# EasyEDA Pro project Solkatstice_v1.0_2025-04-18.epro, board Solkatstice
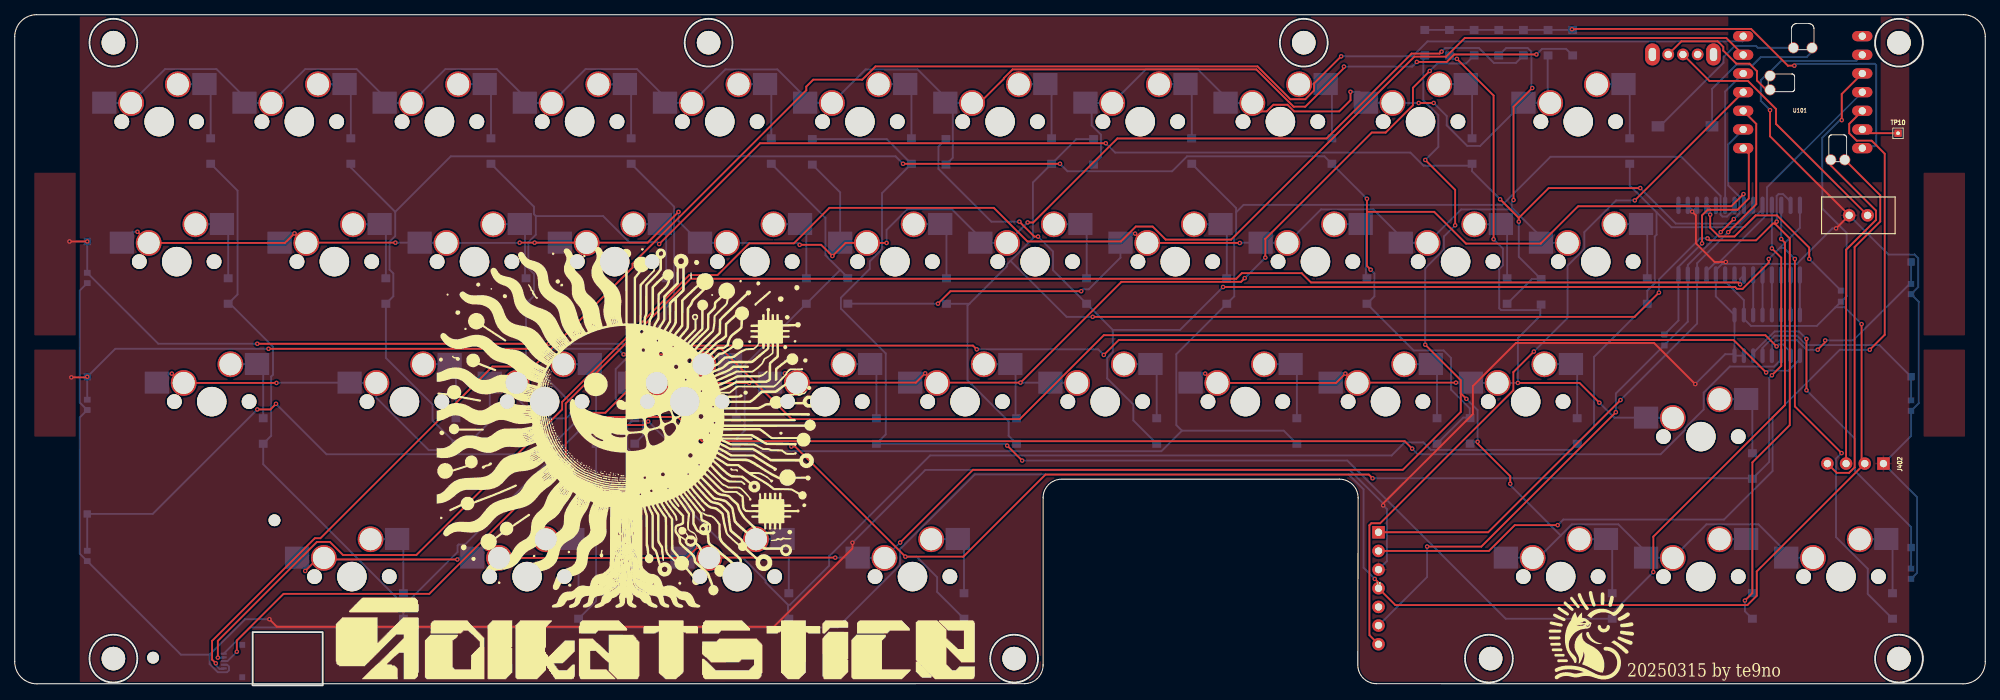
[diagram p1: board, top side]
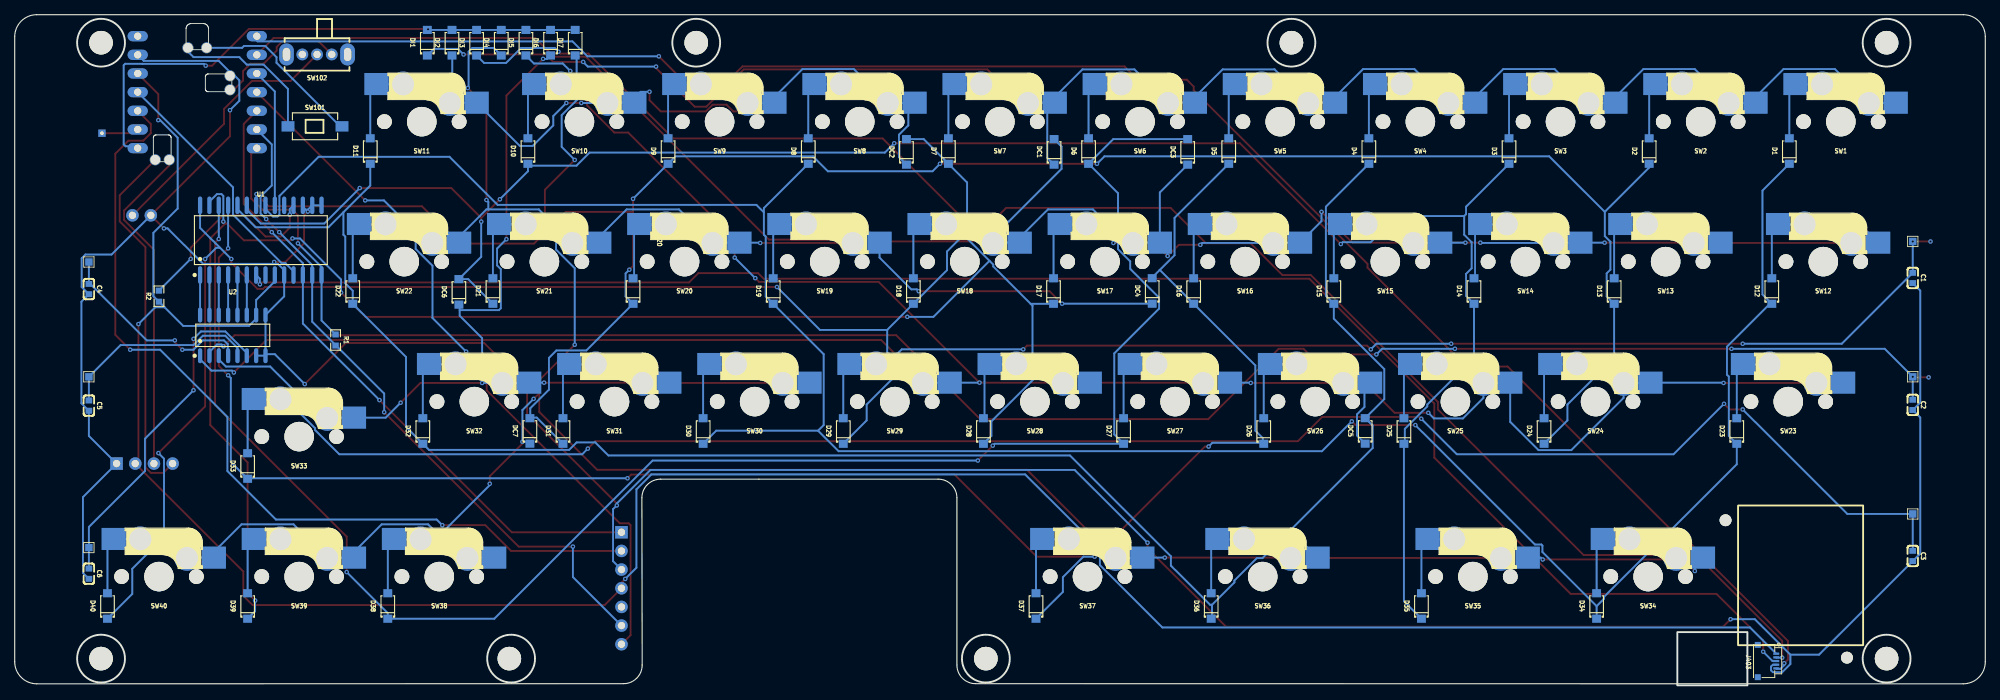
[diagram p2: board, bottom side, seen from below]

Outline 267.84 x 91.26 mm; copper layers: Top Layer, Bottom Layer. Coordinates in mm from the lower left corner of the outline.
Outline path: circle c13.41,87.45 r3.25 ; circle c13.41,3.63 r3.25 ; rectangle 32.33,7.24 41.86,0 ; circle c94.31,87.45 r3.25 ; circle c135.84,3.63 r3.25 ; circle c175.21,87.45 r3.25 ; circle c200.37,3.63 r3.25 ; circle c256.11,87.45 r3.25 ; circle c256.11,3.63 r3.25 ; 0,88.26 arc(0.88,90.38) 3,91.26 264.84,91.26 arc(266.96,90.38) 267.84,88.26 267.84,3.2 arc(266.96,1.08) 264.84,0.2 185.1,0.22 arc(183.3,0.97) 182.56,2.76 182.6,25.51 arc(181.85,27.31) 180.06,28.05 166.7,28.05 142.32,28.05 arc(140.52,27.31) 139.78,25.51 139.78,2.76 arc(139.04,0.97) 137.24,0.22 3,0.2 arc(0.88,1.08) 0,3.2 0,88.26
Stack: Top Layer 0.035mm / Dielectric1 1.51mm FR4 er 4.5 / Bottom Layer 0.035mm

## Design rules (mm)
spacing safeClearance (default): track to track 0.152, other pairs 0.152 to 0.3
track width trackWidth (default): min 0.127, default 0.254, max 2.54
differential pair differentialPair (default): width min 0.127, default 0.254, max 2.54; gap min 0.152, default 0.152
via viaSize (default): diameter min 0.5, default 0.61, max 10; hole min 0.3, default 0.305, max 6
pour ie1754 uses CopperRegion2
pour ie1755 uses CopperRegion3
pour ie1756 uses CopperRegion5
pour ie1757 uses CopperRegion1
pour ie1758 uses CopperRegion4
pour ie1759 uses CopperRegion

## Placement (name value [footprint] x y rotation side)
BT1  Battery_Cell  [kbd_Parts:Battery_2pin]  250.59 63.96 180 top
C1  4.7n  [C0603]  9.86 55.44 270 bottom
C2  20pF  [C0603]  9.86 38.16 270 bottom
C3  20pF  [C0603]  9.86 17.6 270 bottom
C4  20pF  [C0603]  257.76 53.93 270 bottom
C5  20pF  [C0603]  257.76 38.06 270 bottom
C6  20pF  [C0603]  257.76 15.19 270 bottom
D1  D  [SOD-123_L2.7-W1.6-LS3.8-RD]  26.63 72.71 90 bottom
D2  D  [SOD-123_L2.7-W1.6-LS3.8-RD]  45.68 72.71 90 bottom
D3  D  [SOD-123_L2.7-W1.6-LS3.8-RD]  64.73 72.71 90 bottom
D4  D  [SOD-123_L2.7-W1.6-LS3.8-RD]  83.78 72.71 90 bottom
D5  D  [SOD-123_L2.7-W1.6-LS3.8-RD]  102.83 72.71 90 bottom
D6  D  [SOD-123_L2.7-W1.6-LS3.8-RD]  121.88 72.71 90 bottom
D7  D  [SOD-123_L2.7-W1.6-LS3.8-RD]  140.93 72.71 90 bottom
D8  D  [SOD-123_L2.7-W1.6-LS3.8-RD]  159.98 72.71 90 bottom
D9  D  [SOD-123_L2.7-W1.6-LS3.8-RD]  179.03 72.71 90 bottom
D10  D  [SOD-123_L2.7-W1.6-LS3.8-RD]  198.08 72.71 90 bottom
D11  D  [SOD-123_L2.7-W1.6-LS3.8-RD]  219.52 72.71 90 bottom
D12  D  [SOD-123_L2.7-W1.6-LS3.8-RD]  29.02 53.66 90 bottom
D13  D  [SOD-123_L2.7-W1.6-LS3.8-RD]  50.45 53.66 90 bottom
D14  D  [SOD-123_L2.7-W1.6-LS3.8-RD]  69.5 53.66 90 bottom
D15  D  [SOD-123_L2.7-W1.6-LS3.8-RD]  88.55 53.66 90 bottom
D16  D  [SOD-123_L2.7-W1.6-LS3.8-RD]  107.6 53.66 90 bottom
D17  D  [SOD-123_L2.7-W1.6-LS3.8-RD]  126.65 53.66 90 bottom
D18  D  [SOD-123_L2.7-W1.6-LS3.8-RD]  145.7 53.66 90 bottom
D19  D  [SOD-123_L2.7-W1.6-LS3.8-RD]  164.75 53.66 90 bottom
D20  D  [SOD-123_L2.7-W1.6-LS3.8-RD]  183.8 53.66 90 bottom
D21  D  [SOD-123_L2.7-W1.6-LS3.8-RD]  202.85 53.66 90 bottom
D22  D  [SOD-123_L2.7-W1.6-LS3.8-RD]  221.9 53.66 90 bottom
D23  D  [SOD-123_L2.7-W1.6-LS3.8-RD]  33.78 34.61 90 bottom
D24  D  [SOD-123_L2.7-W1.6-LS3.8-RD]  59.97 34.61 90 bottom
D25  D  [SOD-123_L2.7-W1.6-LS3.8-RD]  79.02 34.61 90 bottom
D26  D  [SOD-123_L2.7-W1.6-LS3.8-RD]  98.07 34.61 90 bottom
D27  D  [SOD-123_L2.7-W1.6-LS3.8-RD]  117.12 34.61 90 bottom
D28  D  [SOD-123_L2.7-W1.6-LS3.8-RD]  136.17 34.61 90 bottom
D29  D  [SOD-123_L2.7-W1.6-LS3.8-RD]  155.22 34.61 90 bottom
D30  D  [SOD-123_L2.7-W1.6-LS3.8-RD]  174.27 34.61 90 bottom
D31  D  [SOD-123_L2.7-W1.6-LS3.8-RD]  193.32 34.61 90 bottom
D32  D  [SOD-123_L2.7-W1.6-LS3.8-RD]  212.37 34.61 90 bottom
D33  D  [SOD-123_L2.7-W1.6-LS3.8-RD]  236.18 29.85 90 bottom
D34  D  [SOD-123_L2.7-W1.6-LS3.8-RD]  52.83 10.8 90 bottom
D35  D  [SOD-123_L2.7-W1.6-LS3.8-RD]  76.64 10.8 90 bottom
D36  D  [SOD-123_L2.7-W1.6-LS3.8-RD]  105.22 10.8 90 bottom
D37  D  [SOD-123_L2.7-W1.6-LS3.8-RD]  129.03 10.8 90 bottom
D38  D  [SOD-123_L2.7-W1.6-LS3.8-RD]  217.13 10.8 90 bottom
D39  D  [SOD-123_L2.7-W1.6-LS3.8-RD]  236.18 10.8 90 bottom
D40  D  [SOD-123_L2.7-W1.6-LS3.8-RD]  255.23 10.8 90 bottom
DC1  D  [SOD-123_L2.7-W1.6-LS3.8-RD]  126.57 72.59 90 bottom
DC2  D  [SOD-123_L2.7-W1.6-LS3.8-RD]  146.64 72.59 90 bottom
DC3  D  [SOD-123_L2.7-W1.6-LS3.8-RD]  108.41 72.59 90 bottom
DC4  D  [SOD-123_L2.7-W1.6-LS3.8-RD]  113.24 53.67 90 bottom
DC5  D  [SOD-123_L2.7-W1.6-LS3.8-RD]  84.28 34.62 90 bottom
DC6  D  [SOD-123_L2.7-W1.6-LS3.8-RD]  207.47 53.54 90 bottom
DC7  D  [SOD-123_L2.7-W1.6-LS3.8-RD]  197.82 34.62 90 bottom
DI1  D  [SOD-123_L2.7-W1.6-LS3.8-RD]  211.76 87.45 90 bottom
DI2  D  [SOD-123_L2.7-W1.6-LS3.8-RD]  208.41 87.45 90 bottom
DI3  D  [SOD-123_L2.7-W1.6-LS3.8-RD]  205.06 87.45 90 bottom
DI4  D  [SOD-123_L2.7-W1.6-LS3.8-RD]  201.71 87.45 90 bottom
DI5  D  [SOD-123_L2.7-W1.6-LS3.8-RD]  198.36 87.45 90 bottom
DI6  D  [SOD-123_L2.7-W1.6-LS3.8-RD]  195.01 87.45 90 bottom
DI7  D  [SOD-123_L2.7-W1.6-LS3.8-RD]  191.66 87.45 90 bottom
J1  ~  [roBa:pmw3610_connector]  185.37 13.21 0 top
J402  Conn_01x08  [display:OLED-128x32]  244.2 28.58 90 top
J403  Conn_01x08  [CONN-SMD_5P-P0.50_AFH34-S05FIA-1H]  29.67 3.3 270 bottom
R1  10K  [R0603]  224.23 46.99 270 bottom
R2  10K  [R0603]  248.23 52.96 90 bottom
REF**  -  [MountingHole:MountingHole_3.2mm_M3]  13.41 3.63 0 top
REF**#2  -  [MountingHole:MountingHole_3.2mm_M3]  256.11 87.45 0 top
REF**#3  -  [MountingHole:MountingHole_3.2mm_M3]  256.11 3.63 0 top
REF**#4  -  [MountingHole:MountingHole_3.2mm_M3]  94.31 87.45 0 top
REF**#5  -  [MountingHole:MountingHole_3.2mm_M3]  135.84 3.63 0 top
REF**#6  -  [MountingHole:MountingHole_3.2mm_M3]  200.61 3.63 0 top
REF**#7  -  [MountingHole:MountingHole_3.2mm_M3]  13.41 87.45 0 top
REF**#8  -  [MountingHole:MountingHole_3.2mm_M3]  175.21 87.45 0 top
SW1  SW_PUSH  [kbd_SW:CherryMX_Hotswap_1u]  19.63 76.71 180 bottom
SW2  SW_PUSH  [kbd_SW:CherryMX_Hotswap_1u]  38.68 76.71 180 bottom
SW3  SW_PUSH  [kbd_SW:CherryMX_Hotswap_1u]  57.73 76.71 180 bottom
SW4  SW_PUSH  [kbd_SW:CherryMX_Hotswap_1u]  76.78 76.71 180 bottom
SW5  SW_PUSH  [kbd_SW:CherryMX_Hotswap_1u]  95.83 76.71 180 bottom
SW6  SW_PUSH  [kbd_SW:CherryMX_Hotswap_1u]  114.88 76.71 180 bottom
SW7  SW_PUSH  [kbd_SW:CherryMX_Hotswap_1u]  133.93 76.71 180 bottom
SW8  SW_PUSH  [kbd_SW:CherryMX_Hotswap_1u]  152.98 76.71 180 bottom
SW9  SW_PUSH  [kbd_SW:CherryMX_Hotswap_1u]  172.03 76.71 180 bottom
SW10  SW_PUSH  [kbd_SW:CherryMX_Hotswap_1u]  191.08 76.71 180 bottom
SW11  SW_PUSH  [kbd_SW:CherryMX_Hotswap_1u]  212.52 76.71 180 bottom
SW12  SW_PUSH  [kbd_SW:CherryMX_Hotswap_1u]  22.02 57.66 180 bottom
SW13  SW_PUSH  [kbd_SW:CherryMX_Hotswap_1u]  43.45 57.66 180 bottom
SW14  SW_PUSH  [kbd_SW:CherryMX_Hotswap_1u]  62.5 57.66 180 bottom
SW15  SW_PUSH  [kbd_SW:CherryMX_Hotswap_1u]  81.55 57.66 180 bottom
SW16  SW_PUSH  [kbd_SW:CherryMX_Hotswap_1u]  100.6 57.66 180 bottom
SW17  SW_PUSH  [kbd_SW:CherryMX_Hotswap_1u]  119.65 57.66 180 bottom
SW18  SW_PUSH  [kbd_SW:CherryMX_Hotswap_1u]  138.7 57.66 180 bottom
SW19  SW_PUSH  [kbd_SW:CherryMX_Hotswap_1u]  157.75 57.66 180 bottom
SW20  SW_PUSH  [kbd_SW:CherryMX_Hotswap_1u]  176.8 57.66 180 bottom
SW21  SW_PUSH  [kbd_SW:CherryMX_Hotswap_1u]  195.85 57.66 180 bottom
SW22  SW_PUSH  [kbd_SW:CherryMX_Hotswap_1u]  214.9 57.66 180 bottom
SW23  SW_PUSH  [kbd_SW:CherryMX_Hotswap_1u]  26.78 38.61 180 bottom
SW24  SW_PUSH  [kbd_SW:CherryMX_Hotswap_1u]  52.97 38.61 180 bottom
SW25  SW_PUSH  [kbd_SW:CherryMX_Hotswap_1u]  72.02 38.61 180 bottom
SW26  SW_PUSH  [kbd_SW:CherryMX_Hotswap_1u]  91.07 38.61 180 bottom
SW27  SW_PUSH  [kbd_SW:CherryMX_Hotswap_1u]  110.12 38.61 180 bottom
SW28  SW_PUSH  [kbd_SW:CherryMX_Hotswap_1u]  129.17 38.61 180 bottom
SW29  SW_PUSH  [kbd_SW:CherryMX_Hotswap_1u]  148.22 38.61 180 bottom
SW30  SW_PUSH  [kbd_SW:CherryMX_Hotswap_1u]  167.27 38.61 180 bottom
SW31  SW_PUSH  [kbd_SW:CherryMX_Hotswap_1u]  186.32 38.61 180 bottom
SW32  SW_PUSH  [kbd_SW:CherryMX_Hotswap_1u]  205.37 38.61 180 bottom
SW33  SW_PUSH  [kbd_SW:CherryMX_Hotswap_1u]  229.18 33.85 180 bottom
SW34  SW_PUSH  [kbd_SW:CherryMX_Hotswap_1u]  45.83 14.8 180 bottom
SW35  SW_PUSH  [kbd_SW:CherryMX_Hotswap_1u]  69.64 14.8 180 bottom
SW36  SW_PUSH  [kbd_SW:CherryMX_Hotswap_1u]  98.22 14.8 180 bottom
SW37  SW_PUSH  [kbd_SW:CherryMX_Hotswap_1u]  122.03 14.8 180 bottom
SW38  SW_PUSH  [kbd_SW:CherryMX_Hotswap_1u]  210.13 14.8 180 bottom
SW39  SW_PUSH  [kbd_SW:CherryMX_Hotswap_1u]  229.18 14.8 180 bottom
SW40  SW_PUSH  [kbd_SW:CherryMX_Hotswap_1u]  248.23 14.8 180 bottom
SW101  TSB008A2530A  [SW-SMD_L6.0-W3.5-LS8.0]  227.03 76.07 0 bottom
SW102  SK12D07VG5  [SW-TH_SK12D07VG5]  226.75 85.85 0 bottom
TP1  TestPoint  [TestPoint:TestPoint_Pad_1.0x1.0mm]  9.86 60.4 180 bottom
TP2  TestPoint  [TestPoint:TestPoint_Pad_1.0x1.0mm]  9.86 41.99 180 bottom
TP3  TestPoint  [TestPoint:TestPoint_Pad_1.0x1.0mm]  9.86 23.32 180 bottom
TP4  TestPoint  [TestPoint:TestPoint_Pad_1.0x1.0mm]  257.76 57.61 180 bottom
TP5  TestPoint  [TestPoint:TestPoint_Pad_1.0x1.0mm]  257.76 41.99 180 bottom
TP6  TestPoint  [TestPoint:TestPoint_Pad_1.0x1.0mm]  257.76 18.75 0 bottom
TP10  TestPoint  [TestPoint:TestPoint_THTPad_1.0x1.0mm_Drill0.5mm]  255.98 75.13 0 top
U1  xiao-ble  [SOIC-28_L17.9-W7.5-P1.27-LS10.3-BL]  234.39 60.58 180 bottom
U2  BS816A-1  [NSOP-16_L9.9-W3.9-P1.27-LS6.0-BL]  238.2 47.62 180 bottom
U101  xiao-ble  [mcu:xiao-ble-tht]  243.03 80.72 0 top
U102  -  [Joystick]  33.6 5.46 180 top

## Footprints (pads in the part's own frame, mm; a bottom-side part is the same pattern mirrored in y, then rotated)
C0603
  rect 0.8x0.9 smd: 1(-0.7,0) 2(0.7,0)
CONN-SMD_5P-P0.50_AFH34-S05FIA-1H
  rect 0.3x0.8 smd: 1(-1,1.254) 2(-0.5,1.256) 3(0,1.256) 4(0.5,1.256) 5(1,1.256)
  rect 0.8x0.8 smd: 6(2.2,-1.256) 7(-2.2,-1.256)
display:OLED-128x32
  round 1.7 hole 1: 1(1.6,-2.18) 2(1.6,-4.72) 3(1.6,-7.26)
  rect 1.7x1.7 hole 1: 4(1.6,-9.8)
Joystick
  round 1.6 hole 1.6: 1(-1.7,-17) 1(14.8,1.7)
kbd_Parts:Battery_2pin
  round 1.7 hole 1: 1(-1.25,0) 2(1.25,0)
kbd_SW:CherryMX_Hotswap_1u
  round 2 hole 2: (-5.08,0) (5.08,0)
  round 4 hole 4: (0,0)
  round 3.5 hole 3: 1(3.81,2.54) 2(-2.54,5.08)
  rect 3.3x3 smd: 1(7.45,2.58) 2(-6.15,5.12)
mcu:xiao-ble-tht
  oval 2.75x1.4 hole 1: 1(-8.095,7.62) 2(-8.095,5.08) 3(-8.095,2.54) 4(-8.095,0) 5(-8.095,-2.54) 6(-8.095,-5.08) 7(-8.095,-7.62) 8(8.095,-7.62) 9(8.095,-5.08) 10(8.095,-2.54) 11(8.095,0) 12(8.095,2.54) 13(8.095,5.08) 14(8.095,7.62)
  round 1.5 hole 1.3: 17(-1.271,6.031) 18(1.269,6.031) 19(-4.446,0.316) 20(-4.446,2.221) 21(3.809,-9.209) 22(5.714,-9.209)
MountingHole:MountingHole_3.2mm_M3
  round 3.2 hole 3.2: (0,0)
NSOP-16_L9.9-W3.9-P1.27-LS6.0-BL
  oval 0.574x2.038 smd: 1(-4.445,-2.769) 2(-3.175,-2.769) 3(-1.905,-2.769) 4(-0.635,-2.769) 5(0.635,-2.769) 6(1.905,-2.769) 7(3.175,-2.769) 8(4.445,-2.769) 9(4.445,2.769) 10(3.175,2.769) 11(1.905,2.769) 12(0.635,2.769) 13(-0.635,2.769) 14(-1.905,2.769) 15(-3.175,2.769) 16(-4.445,2.769)
R0603
  rect 0.806x0.864 smd: 1(-0.753,0) 2(0.753,0)
roBa:pmw3610_connector
  rect 1.7x1.7 hole 1: 1(0,7.62)
  round 1.7 hole 1: 2(0,5.08) 3(0,2.54) 4(0,0) 5(0,-2.54) 6(0,-5.08) 7(0,-7.62)
SOD-123_L2.7-W1.6-LS3.8-RD
  rect 1.1x1.2 smd: 1(-1.735,0) 2(1.735,0)
SOIC-28_L17.9-W7.5-P1.27-LS10.3-BL
  oval 0.574x2.388 smd: 1(-8.255,-4.744) 2(-6.985,-4.744) 3(-5.715,-4.744) 4(-4.445,-4.744) 5(-3.175,-4.744) 6(-1.905,-4.744) 7(-0.635,-4.744) 8(0.635,-4.744) 9(1.905,-4.744) 10(3.175,-4.744) 11(4.445,-4.744) 12(5.715,-4.744) 13(6.985,-4.744) 14(8.255,-4.744) 15(8.255,4.744) 16(6.985,4.744) 17(5.715,4.744) 18(4.445,4.744) 19(3.175,4.744) 20(1.905,4.744) 21(0.635,4.744) 22(-0.635,4.744) 23(-1.905,4.744) 24(-3.175,4.744) 25(-4.445,4.744) 26(-5.715,4.744) 27(-6.985,4.744) 28(-8.255,4.744)
SW-SMD_L6.0-W3.5-LS8.0
  rect 1.74x1.4 smd: 1(-3.67,0) 2(3.67,0)
SW-TH_SK12D07VG5
  oval 1.6x1.6 hole 1: 1(-2,0) 2(0,0) 3(2,0)
  oval 2x3 hole 1x1.8: 4(4.15,0) 5(-4.15,0)
TestPoint:TestPoint_Pad_1.0x1.0mm
  rect 1x1 smd: 1(0,0)
TestPoint:TestPoint_THTPad_1.0x1.0mm_Drill0.5mm
  rect 1x1 hole 0.5: 1(0,0)

## Nets
3.3V: J1.4 J402.3 J403.1 R2.1 U1.9 U2.10 U101.12
GND: BT1.2 C1.2 C2.2 C3.2 C4.2 C5.2 C6.2 J1.3 J402.4 J403.4 U1.10 U1.15 U1.16 U1.17 U2.7 U2.8 U2.9 U101.13 U101.20
BAT+: SW102.1 U101.19
CS1: U1.11 U101.11
CS2: J1.2 U101.10
INT: DI1.2 DI2.2 DI3.2 DI4.2 DI5.2 DI6.2 DI7.2 U101.8
INTA: U1.20 U101.3
MISO: R1.1 U1.14 U101.7
MOSI: J1.6 R1.2 U1.13 U101.6
MOT: J1.7 U101.4
NET-(BT1-+): BT1.1 SW102.2
NET-(D1-A): D1.2 SW1.2
NET-(D2-A): D2.2 SW2.2
NET-(D3-A): D3.2 SW3.2
NET-(D4-A): D4.2 SW4.2
NET-(D5-A): D5.2 SW5.2
NET-(D6-A): D6.2 SW6.2
NET-(D7-A): D7.2 SW7.2
NET-(D8-A): D8.2 SW8.2
NET-(D9-A): D9.2 SW9.2
NET-(D10-A): D10.2 SW10.2
NET-(D11-A): D11.2 SW11.2
NET-(D12-A): D12.2 SW12.2
NET-(D13-A): D13.2 SW13.2
NET-(D14-A): D14.2 SW14.2
NET-(D15-A): D15.2 SW15.2
NET-(D16-A): D16.2 SW16.2
NET-(D17-A): D17.2 SW17.2
NET-(D18-A): D18.2 SW18.2
NET-(D19-A): D19.2 SW19.2
NET-(D20-A): D20.2 SW20.2
NET-(D21-A): D21.2 SW21.2
NET-(D22-A): D22.2 SW22.2
NET-(D23-A): D23.2 SW23.2
NET-(D24-A): D24.2 SW24.2
NET-(D25-A): D25.2 SW25.2
NET-(D26-A): D26.2 SW26.2
NET-(D27-A): D27.2 SW27.2
NET-(D28-A): D28.2 SW28.2
NET-(D29-A): D29.2 SW29.2
NET-(D30-A): D30.2 SW30.2
NET-(D31-A): D31.2 SW31.2
NET-(D32-A): D32.2 SW32.2
NET-(D33-A): D33.2 SW33.2
NET-(D34-A): D34.2 SW34.2
NET-(D35-A): D35.2 SW35.2
NET-(D36-A): D36.2 SW36.2
NET-(D37-A): D37.2 SW37.2
NET-(D38-A): D38.2 SW38.2
NET-(D39-A): D39.2 SW39.2
NET-(D40-A): D40.2 SW40.2
NET-(DC1-K): DC1.1 DI1.1 SW1.1 SW2.1 SW3.1 SW4.1 SW5.1 SW6.1 SW7.1
NET-(DC2-K): DC2.1 DI2.1 SW8.1 SW9.1 SW10.1 SW11.1
NET-(DC3-K): DC3.1 DI3.1 SW12.1 SW13.1 SW14.1 SW15.1 SW16.1 SW17.1 SW18.1
NET-(DC4-K): DC4.1 DI4.1 SW19.1 SW20.1 SW21.1 SW22.1
NET-(DC5-K): DC5.1 DI5.1 SW23.1 SW24.1 SW25.1 SW26.1 SW27.1 SW28.1 SW29.1
NET-(DC6-K): DC6.1 DI6.1 SW30.1 SW31.1 SW32.1 SW33.1
NET-(DC7-K): DC7.1 DI7.1 SW34.1 SW35.1 SW36.1 SW37.1 SW38.1 SW39.1 SW40.1
NET-(SW101-PAD2): SW101.2 U101.18
NET-(U1-~{RESET}): R2.2 U1.18
NET-(U2-KEY1): C1.1 TP1.1 U2.1
NET-(U2-KEY2): C2.1 TP2.1 U2.2
NET-(U2-KEY3): C3.1 TP3.1 U2.3
NET-(U2-KEY4): C4.1 TP4.1 U2.4
NET-(U2-KEY5): C5.1 TP5.1 U2.5
NET-(U2-KEY6): C6.1 TP6.1 U2.6
NET-(U101-A7_SCK{SLASH}1.13): TP10.1 U101.9
NET-(U101-RESET): SW101.1 U101.17
S0: D1.1 D8.1 D12.1 D19.1 D23.1 D30.1 D34.1 U1.21
S1: D2.1 D9.1 D13.1 D20.1 D24.1 D31.1 DC7.2 U1.22
S2: D3.1 D10.1 D14.1 D21.1 D25.1 D35.1 DC6.2 U1.23
S3: D4.1 D11.1 D15.1 D22.1 D32.1 D36.1 DC5.2 U1.24
S4: D5.1 D16.1 D26.1 D33.1 D37.1 DC4.2 U1.25
S5: D6.1 D27.1 D38.1 DC3.2 U1.26
S6: D7.1 D17.1 D28.1 D39.1 DC2.2 U1.27
S7: D18.1 D29.1 D40.1 DC1.2 U1.28
S8: U1.1 U2.16
S9: U1.2 U2.15
S10: U1.3 U2.14
S11: U1.4 U2.13
S12: U1.5 U2.12
S13: U1.6 U2.11
S14: J403.3 U1.7
SCK: J1.1 U1.12 U101.5
SCL: J402.2 U101.21
SDA: J402.1 U101.22
UNCONNECTED-(J1-NC-PAD5): J1.5
UNCONNECTED-(SW102-C-PAD3): SW102.3
UNCONNECTED-(U1-GPB7-PAD8): U1.8
UNCONNECTED-(U1-INTB-PAD19): U1.19
UNCONNECTED-(U101-5V-PAD14): U101.14
X: J403.2 U101.2
Y: J403.5 U101.1

Pads without a net: J403 6 7; SW102 4 5; U102 1

## Via types
v1: diameter 0.61, hole 0.305, Top Layer to Bottom Layer, 138 vias

## Routing (per net, layer and track width the routed paths; a pad name or vN(x,y) marks a point on that pad's centre or on a via; arc(x,y) is an arc through that point)
3.3V: length 339.2
  Top Layer w0.254: U101.12 248.33,80.47 v1(248.33,76.91) ; v1(251.03,49.16) 251.03,30.61 J402.3 236.78,15.49 236.78,12.19 235.51,10.92 187.66,10.92 J1.4 185.37,13.97 v1(184.86,14.48)
  Bottom Layer w0.254: U1.9 232.49,54.97 235.03,52.43 U2.10 235.03,49.89 236.01,48.9 244.93,48.9 247.47,51.44 ; 247.47,51.44 R2.1 249,52.97 249,61.58 245.69,64.88 245.69,74.53 248.08,76.91 v1(248.33,76.91) ; 247.47,51.44 248.74,51.44 v1(251.03,49.16) ; J403.1 31.98,7.87 111.86,7.87 120.35,16.36 120.35,18.54 130.51,28.7 181.31,28.7 183.34,26.67 183.34,16 v1(184.86,14.48)
GND: length 461.3
  Top Layer w0.254: v1(228.42,41) 222.83,46.58 204.04,46.58 198.2,40.74 198.2,36.93 186,24.74 v1(186,24.49) ; v1(232.58,57.61) 231.05,57.61 228.51,60.15 228.51,63.96 v1(228,64.47) ; v1(247.56,62.18) BT1.2 238.58,74.72 v1(238.58,78.27) ; v1(34.62,8.99) 35.64,7.98 103.2,7.98 113.87,18.64 v1(113.87,19.41)
  Bottom Layer w0.254: J1.3 186.51,16.89 186.51,23.98 v1(186,24.49) 186,24.74 181.43,29.31 123.77,29.31 v1(113.87,19.41) ; v1(228,64.47) 228.26,64.72 ; 228.26,64.72 228.68,65.14 U1.17 ; 228.26,64.72 228.01,64.72 U1.16 U1.15 ; v1(228.42,41) 232.49,45.06 233.76,45.06 ; 233.76,45.06 U2.8 U2.7 ; 233.76,45.06 U2.9 231.22,52.93 U1.10 231.31,55.93 231.31,56.59 232.07,57.35 232.58,57.35 ; C1.2 8.84,53.72 8.84,38.48 C2.2 8.84,36.45 8.84,17.92 C3.2 22.6,4.17 26.49,4.17 ; BT1.2 254.67,58.62 258.23,58.62 258.74,58.12 258.74,54.2 C4.2 258.78,52.21 258.78,38.38 C5.2 257.76,33.94 J402.4 258.57,25.6 258.57,15.3 C6.2 ; 232.58,57.35 v1(232.58,57.61) ; 232.58,57.35 242.23,57.35 247.06,62.18 v1(247.56,62.18) ; 26.49,4.17 26.49,2.9 27.6,1.79 28.87,1.79 29.13,2.04 29.13,2.55 28.87,2.8 J403.4 ; 26.49,4.17 31.32,8.99 v1(34.62,8.99) ; U101.13 250.3,84.98 240.11,84.98 238.58,83.45 U101.20 237.92,82.94 237.31,82.34 237.31,79.54 v1(238.58,78.27)
BAT+: length 18.4
  Top Layer w0.254: SW102.1 226.54,87.64 231.47,87.64 232.23,86.88 232.23,86.37 234.01,84.59 235.79,84.59 236.81,83.58 236.81,82.31 238.08,81.04 238.58,81.04
CS1: length 34
  Bottom Layer w0.254: U101.11 238.17,67.77 238.17,64.06 231.57,57.46 231.06,57.46 229.95,56.34 U1.11
CS2: length 119.7
  Top Layer w0.254: U101.10 249.35,76.4 249.35,75.13 250.36,74.12 252.4,74.12 254.17,72.34 254.17,47.7 v1(252.14,45.67) ; J1.2 200.37,18.29 203.88,21.79 v1(209.72,21.79)
  Bottom Layer w0.254: v1(252.14,45.67) 248.08,45.67 238.93,36.53 238.93,29.16 232.33,22.56 210.49,22.56 v1(209.72,21.79)
INT: length 76.8
  Top Layer w0.254: v1(241.88,84.33) 241.01,84.33 236.02,89.32 212.21,89.32 212.17,89.28 v1(211.66,89.28)
  Bottom Layer w0.254: DI1.2 211.75,89.19 ; 211.75,89.19 DI2.2 DI3.2 DI4.2 DI5.2 DI6.2 DI7.2 ; 211.75,89.19 v1(211.66,89.28) ; v1(241.88,84.33) 242.13,84.57 250.47,84.57 250.48,84.58 252.84,84.58 253.03,84.39 253.03,73.61 252.78,73.36 251.38,73.36 U101.8
INTA: length 19
  Bottom Layer w0.254: U101.3 232.49,80.81 U1.20
MISO: length 32.8
  Top Layer w0.254: v1(229.35,60.15) 229.35,63.96 230.11,64.72 234.17,64.72 235.7,66.24 235.7,72.34 U101.7
  Bottom Layer w0.254: R1.1 226.14,49.65 U1.14 226.14,56.94 v1(229.35,60.15)
MOSI: length 93.7
  Top Layer w0.254: v1(233.67,63.45) v1(231.89,61.67) ; v1(217.63,37.17) 199.34,18.88 v1(191.97,18.88)
  Bottom Layer w0.254: v1(231.89,61.67) 227.41,57.19 U1.13 227.41,49.48 224.23,46.31 ; 224.23,46.31 R1.2 ; 224.23,46.31 217.63,39.71 v1(217.63,37.17) ; v1(191.97,18.88) 191.97,14.73 J1.6 ; v1(233.67,63.45) 234.43,64.21 234.43,66.5 232.9,68.02 232.9,73.61 U101.6
MOT: length 98.9
  Top Layer w0.254: J1.7 184.14,6.82 184.14,21.79 184.39,22.05 185.59,22.05 203.69,40.15 203.69,42.62 v1(206.49,45.42) ; U101.4 v1(220.2,65.99)
  Bottom Layer w0.254: v1(206.49,45.42) 211.06,49.99 211.06,57.1 213.34,59.39 213.34,61.67 217.66,65.99 v1(220.2,65.99)
NET-(BT1-+): length 35.4
  Top Layer w0.254: BT1.1 239.4,76.4 239.4,78.44 235.59,82.25 230.36,82.25 SW102.2
NET-(D1-A): length 11.3
  Bottom Layer w0.254: SW1.2 25.73,81.79 ; 25.73,81.79 26.63,80.88 D1.2 ; 25.73,81.79 SW1.2
NET-(D2-A): length 11.3
  Bottom Layer w0.254: 44.78,81.79 45.68,80.88 D2.2 ; 44.78,81.79 SW2.2 ; 44.78,81.79 SW2.2
NET-(D3-A): length 11.3
  Bottom Layer w0.254: SW3.2 63.83,81.79 ; 63.83,81.79 64.73,80.88 D3.2 ; 63.83,81.79 SW3.2
NET-(D4-A): length 11.4
  Bottom Layer w0.254: SW4.2 82.89,81.79 SW4.2 83.78,80.98 D4.2
NET-(D5-A): length 11.4
  Bottom Layer w0.254: D5.2 102.83,80.98 SW5.2 101.94,81.79 SW5.2
NET-(D6-A): length 11.4
  Bottom Layer w0.254: SW6.2 120.99,81.79 SW6.2 121.88,80.98 D6.2
NET-(D7-A): length 11.4
  Bottom Layer w0.254: D7.2 140.93,80.98 SW7.2 140.04,81.79 SW7.2
NET-(D8-A): length 11.4
  Bottom Layer w0.254: SW8.2 159.09,81.79 SW8.2 159.98,80.98 D8.2
NET-(D9-A): length 11.4
  Bottom Layer w0.254: D9.2 179.03,80.98 SW9.2 178.14,81.79 SW9.2
NET-(D10-A): length 11.4
  Bottom Layer w0.254: SW10.2 197.19,81.79 SW10.2 198.08,80.98 D10.2
NET-(D11-A): length 11.3
  Bottom Layer w0.254: SW11.2 218.61,81.79 ; 218.61,81.79 SW11.2 ; 218.61,81.79 219.52,80.88 219.52,74.44
NET-(D12-A): length 11.3
  Bottom Layer w0.254: 28.11,62.74 SW12.2 ; 28.11,62.74 SW12.2 ; 28.11,62.74 29.02,61.83 29.02,55.39
NET-(D13-A): length 11.3
  Bottom Layer w0.254: 49.54,62.74 50.45,61.83 D13.2 ; 49.54,62.74 SW13.2 ; 49.54,62.74 SW13.2
NET-(D14-A): length 11.3
  Bottom Layer w0.254: 68.59,62.74 69.35,61.98 69.35,55.53 D14.2 ; 68.59,62.74 SW14.2 ; 68.59,62.74 SW14.2
NET-(D15-A): length 11.3
  Bottom Layer w0.254: SW15.2 87.64,62.74 ; 87.64,62.74 88.55,61.83 D15.2 ; 87.64,62.74 SW15.2
NET-(D16-A): length 11.3
  Bottom Layer w0.254: 106.69,62.74 SW16.2 ; 106.69,62.74 SW16.2 ; 106.69,62.74 107.6,61.83 D16.2
NET-(D17-A): length 11.3
  Bottom Layer w0.254: 125.74,62.74 125.76,62.74 SW17.2 ; 125.74,62.74 126.65,61.83 D17.2 ; 125.74,62.74 SW17.2
NET-(D18-A): length 11.3
  Bottom Layer w0.254: SW18.2 144.81,62.74 144.79,62.74 ; SW18.2 144.79,62.74 ; 144.79,62.74 145.7,61.83 D18.2
NET-(D19-A): length 11.3
  Bottom Layer w0.254: SW19.2 163.86,62.74 163.84,62.74 ; D19.2 164.75,61.83 163.84,62.74 ; 163.84,62.74 SW19.2
NET-(D20-A): length 11.3
  Bottom Layer w0.254: SW20.2 182.91,62.74 182.89,62.74 ; SW20.2 182.89,62.74 ; 182.89,62.74 183.66,61.98 183.66,55.53 D20.2
NET-(D21-A): length 11.3
  Bottom Layer w0.254: 201.94,62.74 SW21.2 ; 201.94,62.74 SW21.2 ; 201.94,62.74 202.85,61.83 D21.2
NET-(D22-A): length 11.3
  Bottom Layer w0.254: 220.99,62.74 SW22.2 ; 220.99,62.74 SW22.2 ; 220.99,62.74 221.9,61.83 D22.2
NET-(D23-A): length 11.3
  Bottom Layer w0.254: SW23.2 32.87,43.69 ; 32.87,43.69 SW23.2 ; 32.87,43.69 33.78,42.78 D23.2
NET-(D24-A): length 11.3
  Bottom Layer w0.254: 59.07,43.69 59.97,42.78 D24.2 ; 59.07,43.69 SW24.2 ; 59.07,43.69 SW24.2
NET-(D25-A): length 11.3
  Bottom Layer w0.254: D25.2 79.02,42.78 78.12,43.69 ; 78.12,43.69 SW25.2 ; 78.12,43.69 SW25.2
NET-(D26-A): length 11.3
  Bottom Layer w0.254: 97.17,43.69 98.07,42.78 D26.2 ; 97.17,43.69 SW26.2 ; 97.17,43.69 SW26.2
NET-(D27-A): length 11.3
  Bottom Layer w0.254: 116.22,43.69 117.12,42.78 D27.2 ; 116.22,43.69 116.23,43.69 SW27.2 ; 116.22,43.69 SW27.2
NET-(D28-A): length 11.3
  Bottom Layer w0.254: SW28.2 135.27,43.69 ; 135.27,43.69 135.28,43.69 SW28.2 ; 135.27,43.69 136.03,42.93 136.03,36.48 D28.2
NET-(D29-A): length 11.3
  Bottom Layer w0.254: SW29.2 154.32,43.69 ; 154.32,43.69 154.33,43.69 SW29.2 ; 154.32,43.69 155.22,42.78 D29.2
NET-(D30-A): length 11.3
  Bottom Layer w0.254: D30.2 174.27,42.78 173.37,43.69 ; 173.37,43.69 173.38,43.69 SW30.2 ; 173.37,43.69 SW30.2
NET-(D31-A): length 11.3
  Bottom Layer w0.254: D31.2 193.32,42.78 192.42,43.69 ; SW31.2 192.42,43.69 ; 192.42,43.69 SW31.2
NET-(D32-A): length 11.3
  Bottom Layer w0.254: D32.2 212.37,42.78 211.47,43.69 ; 211.47,43.69 SW32.2 ; 211.47,43.69 SW32.2
NET-(D33-A): length 11.4
  Bottom Layer w0.254: SW33.2 235.29,38.93 SW33.2 236.18,38.12 D33.2
NET-(D34-A): length 11.4
  Bottom Layer w0.254: SW34.2 51.94,19.88 SW34.2 52.83,19.07 D34.2
NET-(D35-A): length 11.3
  Bottom Layer w0.254: D35.2 76.64,18.97 75.74,19.88 ; SW35.2 75.74,19.88 ; 75.74,19.88 SW35.2
NET-(D36-A): length 11.3
  Bottom Layer w0.254: 104.31,19.88 SW36.2 ; 104.31,19.88 105.22,18.97 105.22,12.53 ; 104.31,19.88 SW36.2
NET-(D37-A): length 11.4
  Bottom Layer w0.254: SW37.2 128.14,19.88 SW37.2 129.03,19.07 D37.2
NET-(D38-A): length 11.4
  Bottom Layer w0.254: D38.2 217.13,19.07 SW38.2 216.24,19.88 SW38.2
NET-(D39-A): length 11.4
  Bottom Layer w0.254: D39.2 236.18,19.07 SW39.2 235.29,19.88 SW39.2
NET-(D40-A): length 11.4
  Bottom Layer w0.254: D40.2 255.23,19.07 SW40.2 254.34,19.88 SW40.2
NET-(DC1-K): length 242.2
  Top Layer w0.254: v1(206.83,85.85) 195.66,85.85 194.64,84.84 v1(190.58,84.84) ; v1(180.67,84.2) 180.67,84 175.42,78.74 173.83,78.74 168.76,83.82 135.63,83.82 134.45,82.63 134.45,82.55 131.14,79.25 SW7.1
  Bottom Layer w0.254: SW7.1 130.08,79.29 SW7.1 ; SW7.1 126.48,80.05 122.71,83.82 115.65,83.82 SW6.1 111.03,79.29 SW6.1 107.43,80.05 103.66,83.82 96.6,83.82 SW5.1 91.98,79.29 SW5.1 88.38,80.05 84.57,83.86 77.59,83.86 SW4.1 69.37,79.25 SW4.1 69.33,80.05 65.52,83.86 58.54,83.86 SW3.1 50.32,79.25 SW3.1 50.28,80.05 46.47,83.86 39.49,83.86 SW2.1 31.27,79.25 SW2.1 31.23,80.05 27.42,83.86 20.44,83.86 SW1.1 12.22,79.25 SW1.1 ; SW7.1 127.5,78.27 127.5,71.79 DC1.1 ; v1(206.83,85.85) 207.59,86.61 210.87,86.61 DI1.1 ; v1(190.58,84.84) 189.94,84.2 v1(180.67,84.2)
NET-(DC2-K): length 93.1
  Top Layer w0.254: SW9.1 169.37,78.1 170.18,78.1 171.08,79.01 172.99,79.01 173.89,78.1 180.04,78.1 181.56,79.63 v1(181.56,80.77) ; v1(190.83,79.25) v1(192.86,79.25)
  Bottom Layer w0.254: 146.63,79.25 146.38,78.99 146.38,76.2 147.65,74.93 147.65,71.88 DC2.1 ; 146.63,79.25 145.57,79.25 SW8.1 ; 146.63,79.25 SW8.1 153.79,83.86 160.77,83.86 164.58,80.05 SW9.1 164.62,79.25 SW9.1 ; 208.37,79.29 208.37,85.68 DI2.1 ; 208.37,79.29 SW11.1 ; 208.37,79.29 SW11.1 199.18,73.41 197.43,73.41 194.64,76.2 194.64,77.47 v1(192.86,79.25) ; v1(181.56,80.77) 182.76,80.77 183.81,79.72 183.81,79.47 SW10.1 187.23,79.29 SW10.1 v1(190.83,79.25)
NET-(DC3-K): length 243.8
  Top Layer w0.254: v1(193.94,86.23) 193.68,85.97 189.87,85.97 178.32,74.42 149.87,74.42 138.44,62.99 v1(137.68,62.99) ; v1(51.74,60.24) 39.68,60.24 ; 39.68,60.24 SW13.1 ; 39.68,60.24 39.3,60.24 v1(38.03,61.51) 36.72,60.2 SW12.1 v1(16.68,61.72) ; v1(90.22,64.43) 86.03,60.24 v1(70.66,60.24) v1(68.63,60.24) ; v1(106.69,59.94) 109.62,59.94 v1(111.14,58.42) 112.92,60.2 SW17.1 v1(118.51,60.2)
  Bottom Layer w0.254: SW17.1 112.2,67.07 DC3.1 ; SW17.1 115.8,60.24 SW17.1 ; SW17.1 111.14,59.18 v1(111.14,58.42) ; v1(137.68,62.99) SW18.1 134.85,60.24 SW18.1 131.21,60.28 131.21,60.96 127.4,64.77 121.3,64.77 118.51,61.98 v1(118.51,60.2) ; v1(38.03,61.51) 37.27,61.51 SW13.1 ; v1(106.69,59.94) 106.44,60.2 SW16.1 96.75,60.24 SW16.1 90.22,63.16 v1(90.22,64.43) ; v1(70.66,60.24) SW15.1 77.7,60.24 SW15.1 ; SW12.1 16.05,61.72 v1(16.68,61.72) ; DI3.1 204.05,84.7 201.05,84.7 199.02,86.73 194.44,86.73 v1(193.94,86.23) ; v1(51.74,60.24) SW14.1 58.65,60.24 SW14.1 68.59,60.2 v1(68.63,60.24)
NET-(DC4-K): length 139.8
  Top Layer w0.254: v1(203.72,66.04) 203.72,78.74 v1(206.26,81.28) ; v1(166.51,60.2) SW19.1 153.56,60.2 v1(152.29,61.47) ; v1(125.49,51.94) 127.18,53.63 v1(144.96,53.63)
  Bottom Layer w0.254: v1(125.49,51.94) DC4.1 ; DI4.1 202.73,86.73 205.64,86.73 206.15,86.23 206.15,81.39 v1(206.26,81.28) ; v1(203.72,66.04) 203.47,65.79 203.47,64.77 ; 203.47,64.77 203.72,64.77 207.45,61.04 SW22.1 211.05,60.24 SW22.1 ; 203.47,64.77 196.61,64.77 SW21.1 192,60.24 SW21.1 188.4,61.04 184.67,64.77 177.56,64.77 SW20.1 172.95,60.24 SW20.1 166.55,60.24 v1(166.51,60.2) ; v1(152.29,61.47) 151.53,61.47 SW19.1 150.3,58.21 145.98,53.89 145.22,53.89 v1(144.96,53.63)
NET-(DC5-K): length 243.8
  Top Layer w0.254: v1(99.84,41.15) SW26.1 86.88,41.15 v1(85.61,42.42) 80.28,37.08 v1(75.71,37.08) ; v1(167.19,55.41) 166.68,54.9 150.42,54.9 v1(136.71,41.19) 125.4,41.19 ; 125.4,41.19 125.02,41.19 v1(123.75,42.46) 122.48,41.19 106.35,41.19 ; 125.4,41.19 SW28.1 ; v1(169.98,58.21) 169.98,60.75 184.46,75.22 186.35,75.22 190.05,78.93 190.05,81.32 v1(192.33,83.61) ; 106.35,41.19 SW27.1 ; 106.35,41.19 105.97,41.19 v1(104.7,42.46) ; v1(35.58,41.15) SW23.1 22.62,41.15 v1(21.35,42.42)
  Bottom Layer w0.254: DI5.1 197.26,84.62 193.35,84.62 v1(192.33,83.61) ; v1(136.71,41.19) SW29.1 144.37,41.19 SW29.1 ; DC5.1 85.4,34.01 85.4,36.87 84.38,37.89 84.38,41.19 ; v1(85.61,42.42) 84.38,41.19 ; 84.38,41.19 SW26.1 ; v1(104.7,42.46) 103.94,42.46 SW27.1 99.88,41.19 v1(99.84,41.15) ; SW23.1 20.56,42.42 v1(21.35,42.42) ; v1(35.58,41.15) 35.62,41.19 SW24.1 45.56,41.15 SW24.1 49.16,39.12 56.27,32 60.72,32 64.57,35.85 SW25.1 64.61,41.15 SW25.1 68.21,39.12 71.01,36.32 74.95,36.32 v1(75.71,37.08) ; v1(167.19,55.41) v1(169.98,58.21) ; v1(123.75,42.46) 122.99,42.46 SW28.1
NET-(DC6-K): length 127.8
  Top Layer w0.254: v1(195.89,41.19) 182.68,41.19 182.64,41.15 182.13,41.15 v1(180.86,42.42) 179.59,41.15 SW30.1 163.08,41.15 v1(161.81,42.42) ; v1(196.03,85.25) 201.01,80.26 v1(201.01,60.71) ; v1(204.31,41.15) 212.69,41.15 v1(215.38,38.46)
  Bottom Layer w0.254: v1(195.89,41.19) SW32.1 197.96,41.15 SW32.1 v1(204.31,41.15) 204.31,47.24 207.36,50.29 207.36,51.05 ; v1(161.81,42.42) 161.05,42.42 SW30.1 ; 207.36,51.05 207.36,51.7 DC6.1 ; 207.36,51.05 202.03,51.05 201.77,51.31 201.77,56.64 202.28,57.15 202.28,59.44 v1(201.01,60.71) ; SW33.1 225.33,36.43 SW33.1 217.42,36.43 v1(215.38,38.46) ; DI6.1 195.48,85.25 v1(196.03,85.25) ; v1(180.86,42.42) 180.1,42.42 SW31.1
NET-(DC7-K): length 305.4
  Top Layer w0.254: v1(191.72,46.35) 196.55,41.52 196.55,39.74 ; v1(191.72,71.49) 195.79,67.43 v1(195.79,62.6) ; v1(64.18,18.61) 65.45,17.34 SW35.1 91.36,17.34 v1(92.88,18.86) SW36.1 94.45,17.38 v1(111.53,17.38) ; v1(198.83,33.14) 198.83,32.89 203.28,28.44 v1(203.28,27.43) ; 196.55,39.74 196.55,37.2 188.67,29.33 130.25,29.33 v1(120.35,19.42) ; 196.55,39.74 v1(197.31,38.98) ; v1(39.48,15.56) 41.26,17.34 SW34.1 42.23,17.12 v1(60.16,17.12)
  Bottom Layer w0.254: 210.13,20.38 207.09,17.34 SW38.1 206.28,17.38 SW38.1 ; 210.13,20.38 203.28,27.24 v1(203.28,27.43) ; 210.13,20.38 211.66,21.91 217.96,21.91 221.73,18.14 SW39.1 225.33,17.38 SW39.1 229.95,21.91 237.01,21.91 240.78,18.14 SW40.1 244.38,17.38 SW40.1 ; v1(197.31,38.98) 198.83,37.46 v1(198.83,33.14) 198.07,33.14 DC7.1 ; v1(111.53,17.38) SW37.1 114.62,17.34 SW37.1 120.31,19.42 v1(120.35,19.42) ; v1(60.16,17.12) 60.41,17.38 SW35.1 63.42,18.61 v1(64.18,18.61) ; SW34.1 39.48,16.28 v1(39.48,15.56) ; v1(191.72,71.49) 193.5,73.27 193.5,77.59 191.47,79.62 191.47,85.53 DI7.1 ; SW36.1 92.25,18.86 v1(92.88,18.86) ; v1(195.79,62.6) 194.26,61.08 194.26,59.3 191.72,56.76 v1(191.72,46.35)
NET-(SW101-PAD2): length 21.3
  Bottom Layer w0.254: U101.18 244.3,86.25 243.54,85.48 237.31,85.48 236.3,84.47 234.01,84.47 230.71,81.17 230.71,76.09 SW101.2
NET-(U1-~{RESET}): length 27.9
  Top Layer w0.254: v1(243.92,58.03) 243.92,59.55 239.52,63.95 236.62,63.95 233.76,61.08 231.65,61.08 230.45,62.27 v1(230.45,64.05)
  Bottom Layer w0.254: R2.2 v1(243.92,58.03) ; v1(230.45,64.05) 230.45,64.81 U1.18
NET-(U2-KEY1): length 248.4
  Top Layer w0.254: v1(238.06,42.57) 233.63,46.99 150.07,46.99 v1(148.03,44.96) ; v1(9.86,60.4) v1(7.44,60.4) ; v1(130.76,45.72) 130.25,46.23 84.03,46.23 v1(83.52,45.72) ; v1(32.97,46.48) v1(72.6,46.48)
  Bottom Layer w0.254: v1(130.76,45.72) 147.27,45.72 v1(148.03,44.96) ; U2.1 242.65,44.37 241.1,42.82 238.31,42.82 v1(238.06,42.57) ; v1(72.6,46.48) 82.76,46.48 v1(83.52,45.72) ; v1(9.86,60.4) C1.1 19.51,46.48 v1(32.97,46.48)
NET-(U2-KEY2): length 249.4
  Top Layer w0.254: v1(7.7,41.91) 9.78,41.91 v1(9.86,41.99) ; v1(239.47,46.13) 237.95,47.65 148.03,47.65 136.6,36.22 105.62,36.22 96.04,45.8 92.66,45.8 91.9,45.04 v1(82.76,45.04) ; v1(34.5,45.8) v1(72.09,45.8)
  Bottom Layer w0.254: U2.2 241.38,45.36 240.36,46.38 239.73,46.38 v1(239.47,46.13) ; C2.1 v1(9.86,41.99) 13.67,45.8 v1(34.5,45.8) ; v1(72.09,45.8) 81.99,45.8 v1(82.76,45.04)
NET-(U2-KEY3): length 255.9
  Top Layer w0.254: v1(189.94,32.21) 188.93,33.22 93.42,33.22 90.12,36.53 76.91,36.53 v1(76.66,36.27) ; v1(35.51,38.3) 34.75,37.54 v1(32.97,37.54)
  Bottom Layer w0.254: U2.3 240.11,44.35 239.14,43.38 233.12,43.38 229.57,39.83 229.57,37.54 227.03,35 227.03,34.75 223.73,31.45 190.71,31.45 v1(189.94,32.21) ; v1(76.66,36.27) 71.83,31.45 42.37,31.45 v1(35.51,38.3) ; C3.1 TP3.1 18.75,23.32 v1(32.97,37.54)
NET-(U2-KEY4): length 28.1
  Top Layer w0.254: v1(246.08,46.94) 246.08,46.69 v1(245.06,45.67)
  Bottom Layer w0.254: TP4.1 257.76,54.81 ; 257.76,54.81 249.89,46.94 v1(246.08,46.94) ; 257.76,54.81 C4.1 ; v1(245.06,45.67) 243.54,45.67 242.27,46.94 239.4,46.94 238.89,46.43 238.89,44.91 U2.4
NET-(U2-KEY5): length 27.5
  Bottom Layer w0.254: C5.1 TP5.1 253.44,46.31 243.54,46.31 242.27,47.58 239.22,47.58 237.57,45.92 U2.5
NET-(U2-KEY6): length 46.4
  Top Layer w0.254: v1(243.54,40.15) v1(243.54,47.14)
  Bottom Layer w0.254: C6.1 TP6.1 257.76,21.54 250.14,29.16 250.14,33.55 v1(243.54,40.15) ; U2.6 236.3,45.23 239.22,48.16 242.52,48.16 v1(243.54,47.14)
NET-(U101-A7_SCK{SLASH}1.13): length 5.1
  Top Layer w0.254: U101.9 251.63,75.13 TP10.1
NET-(U101-RESET): length 23.5
  Bottom Layer w0.254: 223.36,76.07 223.92,76.64 224.18,76.64 232.26,84.72 232.26,85.48 233.78,87.01 236.68,87.01 236.93,86.75 U101.17
S0: length 330.2
  Top Layer w0.254: v1(77.47,35.41) 85.59,35.41 v1(86.1,35.92)
  Bottom Layer w0.254: 52.83,10.78 51.81,11.79 51.81,12.04 33.78,30.08 D23.1 34.86,33.95 34.86,42.02 35.11,42.27 35.11,46.08 29.27,51.92 29.02,51.92 30.29,53.19 30.29,67.32 D1.1 ; 52.83,10.78 D34.1 ; 52.83,10.78 60.19,18.14 60.19,19.01 60.34,19.16 61.21,19.16 v1(77.47,35.41) ; 158.65,34.65 155.86,31.86 90.17,31.86 v1(86.1,35.92) ; 158.65,34.65 157.89,35.41 157.89,45.06 D19.1 165.76,52.94 165.76,61.07 166.02,61.32 166.02,64.37 ; 158.65,34.65 172.49,34.65 D30.1 ; 166.02,64.37 166.02,64.94 D8.1 ; 166.02,64.37 167.03,65.38 202.21,65.38 208.75,71.93 226.53,71.93 231.87,66.59 231.87,64.05 232.12,63.8 232.74,63.8 233.76,64.81 U1.21
S1: length 286.9
  Top Layer w0.254: 183.8,64.43 192.94,64.43 197.26,60.11 207.42,60.11 212.5,65.19 233.33,65.19 v1(234.98,66.85) ; 183.8,64.43 183.8,57.07 v1(184.31,56.56) ; 183.8,64.43 v1(183.8,66.21) ; v1(120.74,70.97) v1(142.08,70.97)
  Bottom Layer w0.254: v1(234.98,66.85) 234.98,65.37 U1.22 ; D2.1 45.68,70.46 51.72,64.43 ; 197.77,36.43 197.77,37.7 195.23,40.24 195.23,44.56 194.21,45.57 190.15,45.57 D20.1 184.81,52.94 184.81,56.05 v1(184.31,56.56) ; 197.77,36.43 DC7.2 ; 197.77,36.43 196.88,36.43 D31.1 ; v1(120.74,70.97) 119.73,71.99 59.27,71.99 51.72,64.43 ; v1(183.8,66.21) D9.1 178.02,71.99 159.35,71.99 157.32,69.96 143.09,69.96 v1(142.08,70.97) ; 51.72,64.43 51.72,61.13 50.96,60.37 50.96,56.56 51.46,56.05 51.46,52.94 D13.1 50.45,44.56 56.8,38.21 56.8,36.05 D24.1
S2: length 268.9
  Top Layer w0.254: v1(201.89,66.15) 204.43,63.61 ; 204.43,63.61 v1(204.43,63.1) ; 204.43,63.61 208.5,67.67 v1(220.94,67.67) ; v1(148.3,73.77) 101.31,73.77 v1(87.59,60.05)
  Bottom Layer w0.254: v1(201.89,66.15) 198.08,69.96 D10.1 197.83,70.72 191.48,70.72 189.7,72.5 149.57,72.5 v1(148.3,73.77) ; v1(204.43,63.1) 204.43,58.31 DC6.2 206.2,55.28 D21.1 ; 70.83,63.86 79.97,63.86 83.53,60.3 87.34,60.3 v1(87.59,60.05) ; 70.83,63.86 70.83,61.32 69.81,60.3 69.81,56.75 70.58,55.99 70.58,53 D14.1 69.5,44.56 75.85,38.21 75.85,37.95 78.9,34.9 78.9,33 D25.1 79.02,11.44 D35.1 ; 70.83,63.86 70.58,64.11 70.58,65.13 D3.1 ; v1(220.94,67.67) 225.77,62.84 234.41,62.84 236.3,64.73 U1.23
S3: length 257.5
  Bottom Layer w0.254: 105.11,10.96 102.06,14 102.06,14.26 99.01,17.31 98.25,17.31 83.26,32.29 83.26,35.34 DC5.2 81.69,38.95 81.69,43.03 88.55,49.89 D15.1 89.63,53 89.63,65.13 D4.1 ; 105.11,10.96 105.11,9.17 105.22,9.06 ; 105.11,10.96 105.36,10.96 110.7,16.29 110.7,17.56 124.41,31.28 187.15,31.28 188.93,33.05 191.47,33.05 192.48,32.04 211.54,32.04 D32.1 214.66,35.16 214.66,44.68 D22.1 221.9,53.7 222.91,54.72 222.91,61.07 223.17,61.32 223.17,64.37 ; 223.17,64.37 219.52,68.02 219.52,70.97 ; 223.17,64.37 225.2,62.34 235.11,62.34 237.57,64.8 U1.24
S4: length 250.7
  Top Layer w0.254: v1(105.56,32.49) 106.07,32.49 v1(121.06,17.51) 128.93,17.51 140.11,28.68 184.05,28.68 v1(184.56,28.17) ; v1(238.84,42.19) 240.11,43.46 240.11,58.19 v1(238.84,59.46)
  Bottom Layer w0.254: 112.23,56.49 113.24,55.49 DC4.2 ; 112.23,56.49 112.17,56.49 D16.1 99.22,43.54 99.22,34.65 98.2,33.63 98.2,33 ; 112.23,56.49 110.2,58.53 110.2,63.61 D5.1 ; D37.1 125.38,12.71 125.38,14.71 122.58,17.51 v1(121.06,17.51) ; 98.2,33 105.06,33 v1(105.56,32.49) ; 98.2,33 D26.1 ; v1(238.84,59.46) U1.25 ; v1(238.84,42.19) 238.47,41.83 238.47,30.4 D33.1 236.12,28.17 v1(184.56,28.17)
S5: length 236.1
  Top Layer w0.254: v1(134.9,32.62) v1(136.93,30.59) ; v1(222.72,15.41) 222.72,20.24 240.61,38.13 240.61,60.23 v1(240.11,60.73)
  Bottom Layer w0.254: v1(222.72,15.41) 217.13,9.82 D38.1 202.66,9.06 181.13,30.59 v1(136.93,30.59) ; DC3.2 118.53,74.33 D6.1 117.88,66.97 117.88,59.35 116.22,57.69 116.22,56.68 112.3,52.75 112.3,51.26 118.39,45.17 118.39,34.14 D27.1 134.65,32.87 v1(134.9,32.62) ; v1(240.11,60.73) U1.26
S6: length 233.7
  Top Layer w0.254: 239.23,62.84 v1(239.49,63.1) ; 239.23,62.84 238.98,62.84 236.69,60.56 230.34,60.56 v1(230.09,60.81) ; 239.23,62.84 241.26,60.81 241.26,35.41 236.18,30.33 236.18,12.55 v1(235.17,11.54) ; v1(223.48,53.45) 220.18,50.14 v1(146.52,50.14)
  Bottom Layer w0.254: 135.35,57.76 142.97,50.14 v1(146.52,50.14) ; 135.35,57.76 134.84,57.26 134.84,57 129.76,51.92 ; 135.35,57.76 138.39,60.81 138.39,68.43 D7.1 144.29,74.33 DC2.2 ; 129.76,51.92 129.5,51.67 129.5,41.51 135.09,35.92 135.09,33.95 D28.1 ; 129.76,51.92 D17.1 ; D39.1 235.17,10.08 v1(235.17,11.54) ; v1(230.09,60.81) 229.07,60.81 223.48,55.22 v1(223.48,53.45) ; U1.27 241.38,65.83 240.36,66.85 239.74,66.85 239.49,66.59 v1(239.49,63.1)
S7: length 217.8
  Top Layer w0.254: v1(238.41,58.02) 238.41,57.51 234.85,53.95 234.09,53.95 233.84,54.21 v1(164.24,54.21) ; v1(139.09,61.07) 138.59,61.07 v1(136.55,63.1) ; v1(241.96,58.02) 241.96,37.95 v1(248.31,31.6)
  Bottom Layer w0.254: 239.93,59.54 242.65,62.26 U1.28 ; 239.93,59.54 v1(238.41,58.02) ; 239.93,59.54 240.44,59.54 v1(241.96,58.02) ; 149.25,48.37 158.4,48.37 v1(164.24,54.21) ; 149.25,48.37 D18.1 141.12,56.49 141.12,59.03 v1(139.09,61.07) ; 149.25,48.37 149.25,45.32 148.49,44.56 148.49,41.76 152.05,38.21 152.05,36.05 D29.1 ; DC1.2 125.56,73.31 125.56,70.29 132.74,63.1 v1(136.55,63.1) ; D40.1 251.87,12.43 251.87,15.85 247.55,20.17 247.55,30.84 v1(248.31,31.6)
S8: length 5.4
  Bottom Layer w0.254: U2.16 U1.1
S9: length 5.4
  Bottom Layer w0.254: U2.15 U1.2
S10: length 5.4
  Bottom Layer w0.254: U2.14 U1.3
S11: length 5.4
  Bottom Layer w0.254: U2.13 U1.4
S12: length 5.4
  Bottom Layer w0.254: U2.12 U1.5
S13: length 5.4
  Bottom Layer w0.254: U2.11 U1.6
S14: length 235.3
  Top Layer w0.254: v1(30.19,4.57) 30.19,6.1 36.54,12.45 56.35,12.45 74.89,30.99 74.89,38.35 91.87,55.33 166.03,55.33 166.8,56.09 174.92,56.09 176.19,54.82 234.26,54.82 v1(234.52,54.56)
  Bottom Layer w0.254: U1.7 234.52,55.33 v1(234.52,54.56) ; J403.3 28.92,3.3 v1(30.19,4.57)
SCK: length 88.1
  Top Layer w0.254: v1(218.26,38.82) 200.27,20.83 J1.1 ; U101.5 236.71,76.4 236.71,65.48 v1(232.9,61.67)
  Bottom Layer w0.254: v1(232.9,61.67) 228.68,57.45 U1.12 228.68,49.23 v1(218.26,38.82)
SCL: length 45.6
  Top Layer w0.254: U101.21 246.84,70.75 252.98,64.61 252.98,63.34 248.92,59.27 J402.2
SDA: length 49.8
  Top Layer w0.254: J402.1 247.65,28.91 249.32,28.91 250.08,29.67 250.08,59.64 253.57,63.13 253.57,66.69 U101.22
X: length 252.7
  Top Layer w0.254: v1(27.61,3.76) 27.61,6.05 41.07,19.51 42.85,19.51 44.63,17.73 54.6,17.73 74.41,37.54 74.41,38.56 91.68,55.83 95.53,55.83 99.85,60.15 105.9,60.15 110.73,64.97 133.08,64.97 137.65,60.4 150.35,60.4 152.39,62.43 154.67,62.43 156.45,60.66 165.34,60.66 190.23,85.55 194.55,85.55 197.09,88.09 232.65,88.09 U101.2
  Bottom Layer w0.254: J403.2 28.37,3.76 v1(27.61,3.76)
Y: length 252.4
  Top Layer w0.254: v1(27.33,3) 26.82,3.51 26.82,6.05 40.79,20.02 41.55,20.02 64.92,43.38 70.51,43.38 83.97,56.85 83.97,57.35 107.59,80.98 107.59,81.48 108.53,82.42 115.19,82.42 116.99,84.22 168.92,84.22 173.39,79.76 175.42,79.76 176.6,80.95 176.6,81.91 v1(180.29,85.6)
  Bottom Layer w0.254: v1(27.33,3) 27.33,2.74 27.84,2.24 28.35,2.24 J403.5 ; v1(180.29,85.6) 190,85.6 192.03,87.63 234.84,87.63 235.11,87.91 235.11,88.16 U101.1

## Copper pours and planes (outline as drawn; the poured copper is in the pictures)
GND on Top Layer: 257.44,97.98 271.79,97.98 271.79,-2.98 257.44,-2.98
GND on Top Layer: 8.84,94.81 257.51,94.81 257.51,-6.16 8.84,-6.16
GND on Top Layer: -4.11,96.96 10.24,96.96 10.24,-4 -4.11,-4
GND on Bottom Layer: -3.99,95 268.81,95 268.81,-5.97 -3.99,-5.97
NET-(U2-KEY1) on Top Layer: 2.37,70.05 8.59,70.05 8.59,47.32 2.37,47.32
NET-(U2-KEY2) on Top Layer: 2.37,45.99 8.59,45.99 8.59,33.54 2.37,33.54
NET-(U2-KEY3) on Top Layer: 2.37,32.21 8.59,32.21 8.59,9.48 2.37,9.48
NET-(U2-KEY4) on Top Layer: 259.16,70.05 265.38,70.05 265.38,47.32 259.16,47.32
NET-(U2-KEY5) on Top Layer: 259.16,45.99 265.38,45.99 265.38,33.54 259.16,33.54
NET-(U2-KEY6) on Top Layer: 259.16,32.21 265.38,32.21 265.38,9.48 259.16,9.48

## Text on the board
Top Silkscreen Layer: 20250315 by te9no
